# EAGLE design AuxBreak (EAGLE 6.5.0)
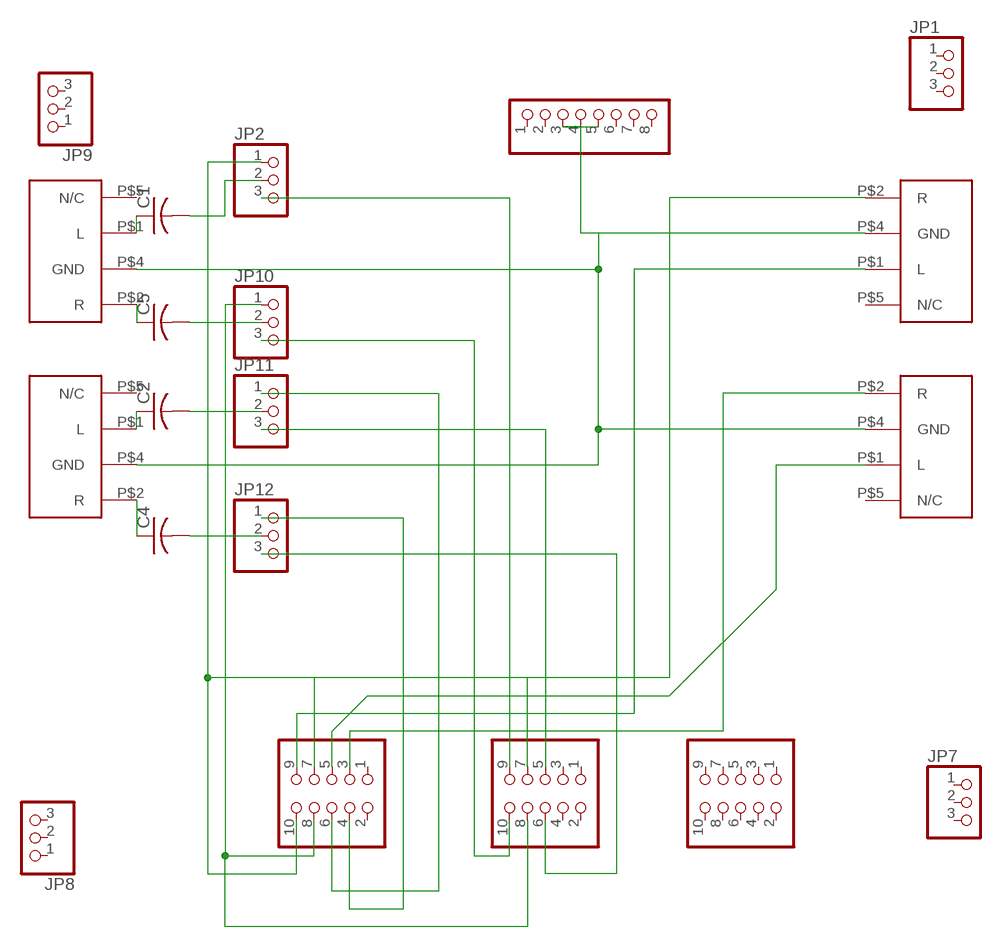
[diagram p0: schematic, sheet 1]

## Parts
C1  C-US025-025X050  [C025-025X050]
C2  C-US025-025X050  [C025-025X050]
C4  C-US025-025X050  [C025-025X050]
C5  C-US025-025X050  [C025-025X050]
JP1  PINHD-1X3  [1X03]
JP2  PINHD-1X3  [1X03]
JP3  PINHD-1X8  [1X08]
JP4  PINHD-2X5/90  [2X05/90]
JP5  PINHD-2X5/90  [2X05/90]
JP6  PINHD-2X5/90  [2X05/90]
JP7  PINHD-1X3  [1X03]
JP8  PINHD-1X3  [1X03]
JP9  PINHD-1X3  [1X03]
JP10  PINHD-1X3  [1X03]
JP11  PINHD-1X3  [1X03]
JP12  PINHD-1X3  [1X03]
U$1  161-3509-E  [161-3509-E]
U$3  161-3509-E  [161-3509-E]
U$4  161-3509-E  [161-3509-E]
U$5  161-3509-E  [161-3509-E]

## Nets
N$1: JP3.3 JP3.4 JP3.5 U$1.P$4(GND) U$3.P$4(GND) U$4.P$4(GND) U$5.P$4(GND)
N$2: C2.1 U$4.P$1(L)
N$3: C4.1 U$4.P$2(R)
N$4: C1.2 JP2.2
N$5: C5.1 U$5.P$2(R)
N$6: JP2.1 JP4.7 JP6.10
N$7: JP4.8 JP6.8 JP10.1
N$8: JP6.6 JP11.1
N$9: JP6.4 JP12.1
N$10: C4.2 JP12.2
N$11: C2.2 JP11.2
N$12: C1.1 U$5.P$1(L)
N$13: C5.2 JP10.2
N$14: JP2.3 JP4.9
N$15: JP4.5 JP11.3
N$16: JP4.10 JP10.3
N$17: JP4.6 JP12.3
N$18: JP6.9 U$3.P$1(L)
N$19: JP6.7 U$3.P$2(R)
N$20: JP6.5 U$1.P$1(L)
N$21: JP6.3 U$1.P$2(R)
Unconnected: JP1.1 JP1.2 JP1.3 JP3.1 JP3.2 JP3.6 JP3.7 JP3.8 JP4.1 JP4.2 JP4.3 JP4.4 JP5.1 JP5.2 JP5.3 JP5.4 JP5.5 JP5.6 JP5.7 JP5.8 JP5.9 JP5.10 JP6.1 JP6.2 JP7.1 JP7.2 JP7.3 JP8.1 JP8.2 JP8.3 JP9.1 JP9.2 JP9.3 U$1.P$5(N/C) U$3.P$5(N/C) U$4.P$5(N/C) U$5.P$5(N/C)

## Library data of the parts
C1 C2 C4 C5 = rcl:C-US: CAPACITOR, American symbol
JP1 JP2 JP7-JP12 = pinhead:PINHD-1X3: PIN HEADER
JP3 = pinhead:PINHD-1X8: PIN HEADER
JP4-JP6 = pinhead:PINHD-2X5: PIN HEADER
U$1 U$3-U$5 = C1-2015:161-3509-E

## Board
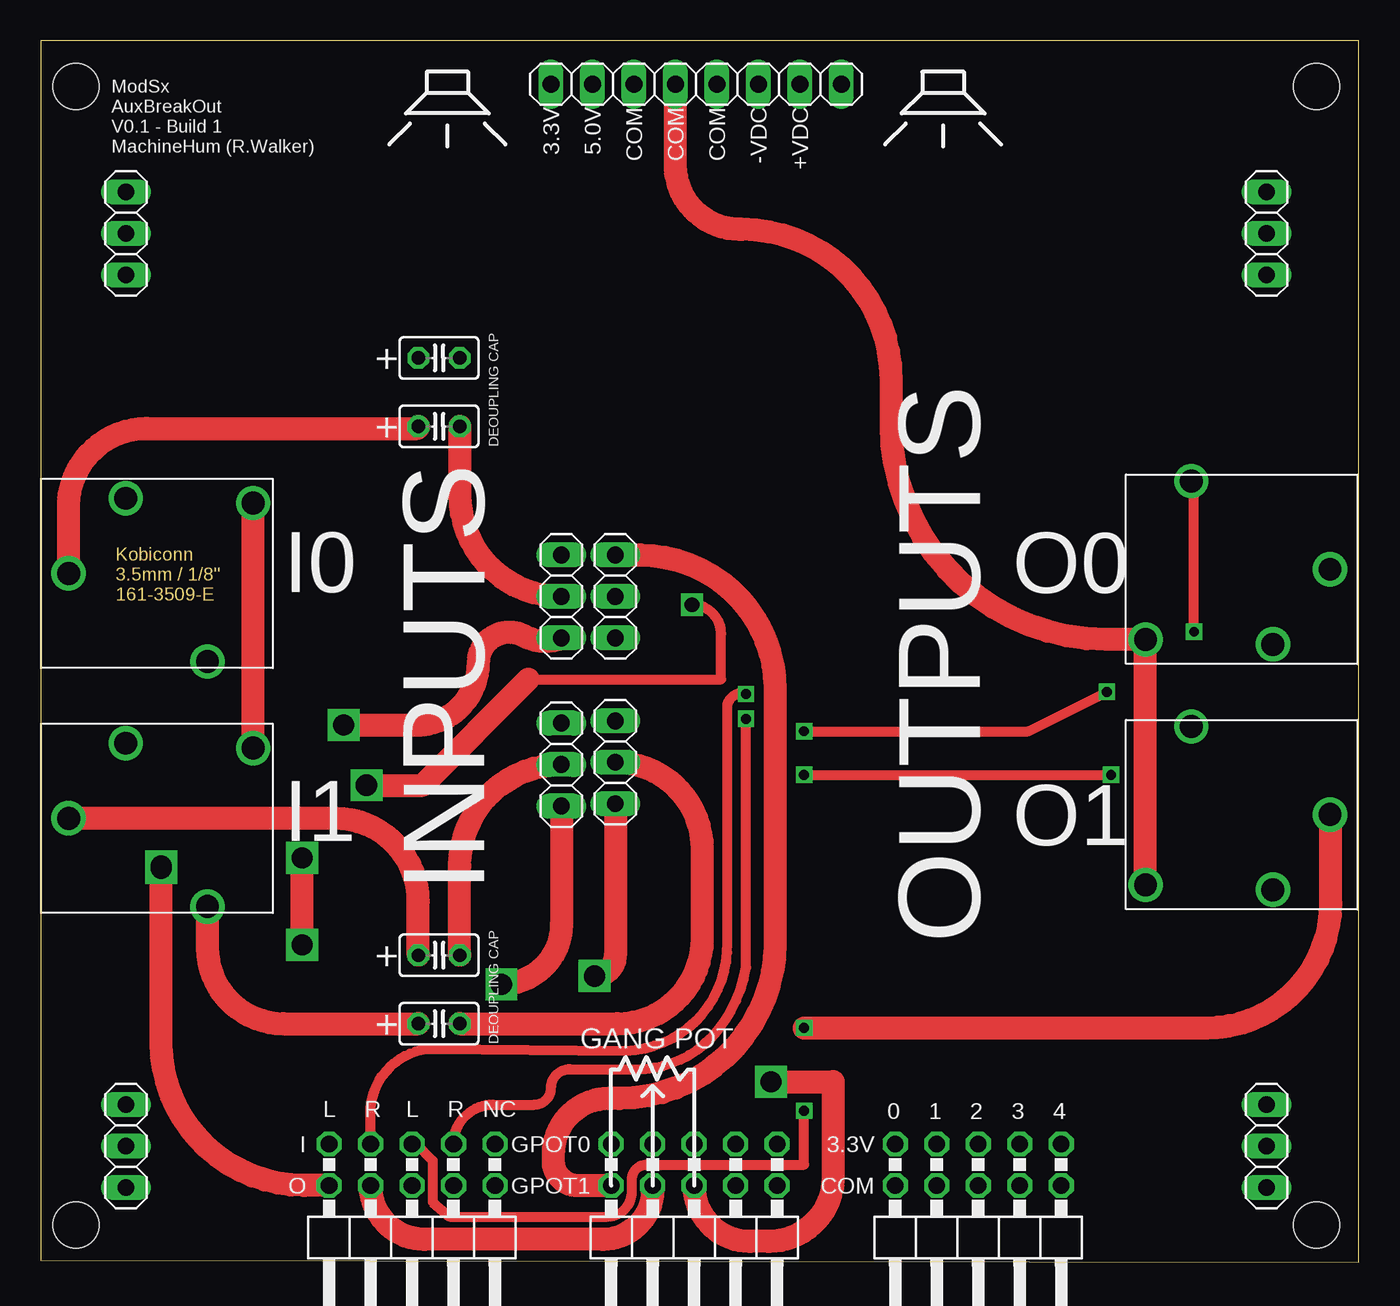
[diagram p1: board, top side]
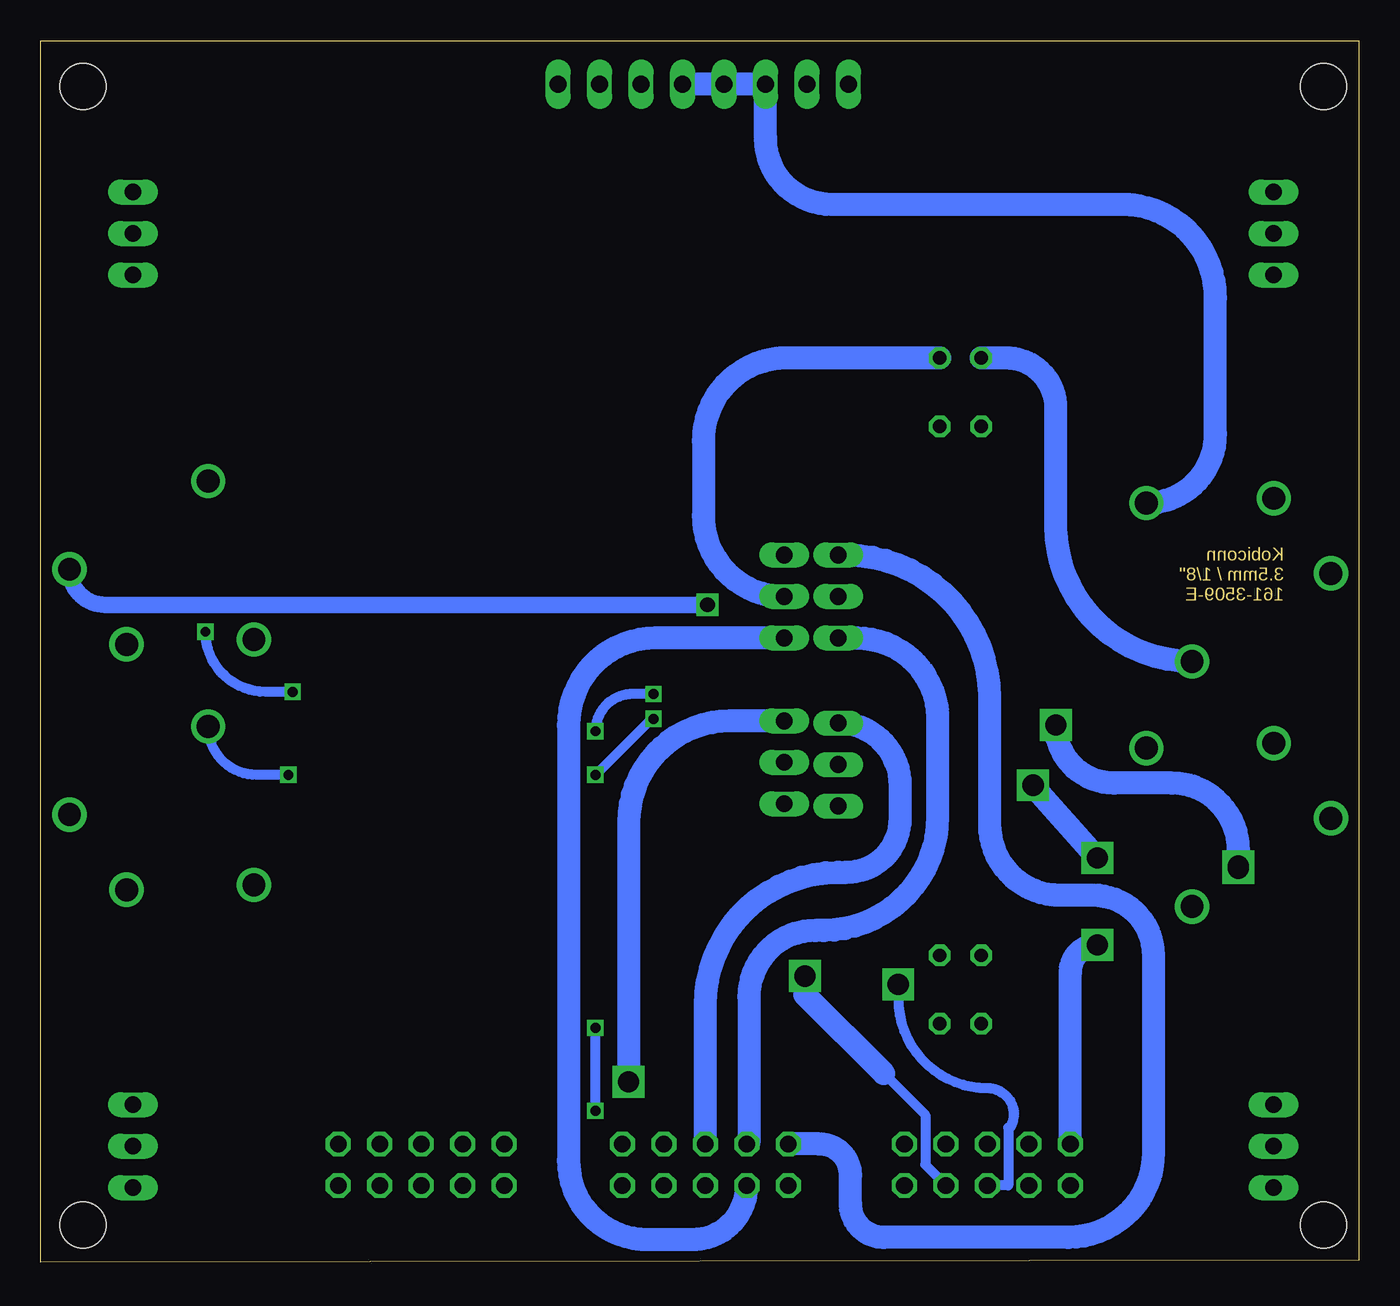
[diagram p2: board, bottom side, seen from below]

Size 80.7 x 74.79 mm. Coordinates in mm from the lower left corner, seen from the top.
Outline: 0,0.13 80.7,0 80.7,74.79 0,74.79 0,0.13
Copper layers (1*16): Top 0.035mm / dielectric 1.5mm / Bottom 0.035mm
Design rules "default": minimum track width 10mil, minimum drill 24mil, track to track 8mil, track to pad 8mil, pad to pad 8mil, via to via 8mil, smd to smd 8mil, copper to edge 40mil, drill to drill 8mil, minimum pad ring 10mil, minimum via ring 8mil, stop-mask expansion 4mil, vias tented up to drill 0mil, thermal gap 10mil
Holes 2.8 mm at 2.16,72.01 2.16,2.29 78.11,72.01 78.11,2.29

### Footprints (pad centres in the part's own frame; a part is rotated, then mirrored left to right if it is on the bottom)
C025-025X050 = drill 0.813 octagon: 1 -1.27,0; 2 1.27,0
1X03 = drill 1.016 long: 1 -2.54,0; 2 0,0; 3 2.54,0
1X08 = drill 1.016 long: 1 -8.89,0; 2 -6.35,0; 3 -3.81,0; 4 -1.27,0; 5 1.27,0; 6 3.81,0; 7 6.35,0; 8 8.89,0
2X05/90 = drill 1.016 octagon: 1 -5.08,-6.35; 2 -5.08,-3.81; 3 -2.54,-6.35; 4 -2.54,-3.81; 5 0,-6.35; 6 0,-3.81; 7 2.54,-6.35; 8 2.54,-3.81; 9 5.08,-6.35; 10 5.08,-3.81
161-3509-E = drill 1.4: P$1 1.7,-5.8; P$2 10.2,-11.2; P$4 13,-1.5; P$5 5.2,-1.2

### Placement (x,y rotation side)
C1  24.38,51.18 0 top
C2  24.38,18.8 0 top
C4  24.38,14.61 0 top
C5  24.38,55.37 0 top
JP1  5.21,62.99 90 top
JP2  31.88,40.77 90 top
JP3  40.13,72.14 0 top
JP4  40.01,0.89 180 top
JP5  57.4,0.89 180 top
JP6  22.73,0.89 180 top
JP7  75.06,62.99 90 top
JP8  5.21,7.11 90 top
JP9  75.06,7.11 90 top
JP10  35.18,40.77 90 top
JP11  31.88,30.48 90 top
JP12  35.18,30.61 90 top
U$1  80.64,21.61 180 top
U$3  80.64,36.64 180 top
U$4  0,32.98 0 top
U$5  0,47.98 0 top

### Tracks (layer width: path | path; a pad name or v marks a point on that pad's centre or on a via)
N$1
  Top 1.422: U$4.P$4 U$5.P$4 | JP3.4 38.86,67.18 arc90 42.8,63.25 42.93,63.25 arc-90 52.07,54.1 52.07,51.31 arc90 65.24,38.14 U$3.P$4 U$1.P$4
  Bottom 1.422: U$5.P$4 arc-90 8.76,50.72 8.76,59.05 arc-90 14.48,64.77 32.26,64.77 arc90 36.32,68.83 JP3.3 JP3.4 JP3.5
N$2
  Top 1.422: C2.1 23.11,22.1 arc90 18.03,27.18 U$4.P$1 arc-90 U$4.P$1
N$3
  Top 1.422: U$4.P$2 10.2,19.26 arc90 14.86,14.61 C4.1
N$4
  Top 1.422: C1.2 25.65,46.99 arc90 JP2.2
N$5
  Bottom 1.422: U$5.P$2 arc90 18.54,45.12 18.54,52.32 arc-90 21.59,55.37 C5.1
N$6  (via drill 1.3)
  Top 1.422: JP6.10 16.13,4.7 arc-90 7.37,13.46 v7.37,24.13 v7.37,24.26 | v18.54,32.89 22.99,32.89 arc90 26.8,36.7 arc-119 29.59,38.35 arc51 JP2.1
  Bottom 1.422: JP2.1 30.73,38.23 arc90 25.78,33.27 25.78,27.3 arc90 32.77,20.32 33.27,20.32 arc-90 37.34,16.26 37.34,7.37 arc90 JP4.7 | v7.37,24.26 7.37,25.27 arc-90 11.43,29.34 14.99,29.34 arc90 v18.54,32.89
N$7
  Top 1.422: JP4.8 37.47,4.44 arc-90 34.42,1.4 23.5,1.4 arc-90 JP6.8
  Bottom 1.422: JP10.1 43.05,38.23 arc-90 48.39,32.89 48.39,6.22 arc-90 43.56,1.4 40.77,1.4 arc-90 JP4.8
N$8  (via drill 1.3)
  Top 1.422: JP11.1 31.88,20.7 arc-90 v28.19,17.02
  Bottom 0.61: v28.19,17.02 28.19,16.13 arc-90 22.73,10.67 arc120 21.34,8.26 21.46,8.26 21.46,4.7 JP6.6
N$9  (via drill 1.3)
  Top 1.422: JP12.1 35.18,18.8 arc-90 v33.91,17.53
  Bottom 0.61: 29.08,11.56 26.54,9.02 26.54,5.97 JP6.4
  Bottom 1.422: v33.91,17.53 33.91,16.38 29.08,11.56
N$10
  Top 1.422: C4.2 35.31,14.61 arc90 40.51,19.81 40.51,25.27 arc90 JP12.2
N$11
  Top 1.422: C2.2 25.65,24.26 arc-90 JP11.2
N$12
  Top 1.422: U$5.P$1 1.7,46.28 arc-90 6.48,51.05 22.99,51.05 arc90 C1.1
N$13
  Bottom 1.422: C5.2 35.05,55.37 arc-90 40.13,50.29 40.13,45.72 arc-90 JP10.2
N$14
  Bottom 1.422: JP2.3 31.37,43.31 arc90 22.61,34.54 22.61,26.8 arc-90 18.29,22.48 16.26,22.48 arc90 12.57,18.8 12.57,6.73 arc90 17.78,1.52 29.08,1.52 arc90 31.11,3.56 31.11,5.33 arc-90 33.02,7.24 JP4.9
N$15
  Bottom 1.422: JP4.5 40.01,15.75 arc90 31.88,23.88 31.37,23.88 arc-90 28.07,27.18 28.07,29.21 arc-90 JP11.3
N$16
  Top 1.422: JP10.3 36.7,43.31 arc-90 44.96,35.05 44.96,19.56 arc-90 35.43,10.03 34.8,10.03 arc90 31.37,6.6 31.37,6.22 arc90 32.89,4.7 JP4.10
N$17  (via drill 1.3)
  Top 1.422: v44.7,11.05 48.51,11.05 48.51,5.21 arc-90 44.58,1.27 43.43,1.27 arc-90 JP4.6
  Bottom 1.422: JP12.3 38.48,33.15 arc-90 44.7,26.92 v44.7,11.05
N$18  (via drill 0.9, 1.3)
  Top 0.61: 29.84,35.69 41.66,35.69 41.66,38.48 arc90 v39.88,40.26
  Top 1.422: v16,19.43 v16,24.77 | v19.94,29.21 23.37,29.21 29.84,35.69
  Bottom 1.016: v39.88,40.26 76.77,40.26 arc90 U$3.P$1
  Bottom 1.422: JP6.9 17.65,17.78 arc90 v16,19.43 | v16,24.77 v19.94,29.21
N$19  (via drill 0.6)
  Top 0.61: JP6.7 20.19,9.02 arc-90 24,13.08 35.81,12.95 arc90 42.04,19.56 42.04,34.16 arc-90 v43.18,34.8 | v46.74,32.51 60.45,32.51 v65.28,34.93 | v70.61,38.61 70.61,47.67 arc90 U$3.P$2
  Bottom 0.61: v43.18,34.8 44.45,34.8 arc-90 v46.74,32.51 | v65.28,34.93 66.93,34.93 arc90 v70.61,38.61
N$20  (via drill 0.6)
  Top 0.61: JP6.5 22.99,7.24 24,6.22 24,3.68 25.02,2.79 34.67,2.79 arc90 36.2,4.32 36.2,5.08 arc-90 37.08,5.97 46.74,5.97 v46.74,9.27 | 78.99,27.36 arc90 U$1.P$1
  Top 1.422: v46.74,14.35 71.37,14.35 arc90 78.99,21.97 78.99,27.36
  Bottom 0.61: v46.74,9.27 v46.74,14.35
N$21  (via drill 0.6)
  Top 0.61: JP6.3 arc-90 27.69,9.65 30.23,9.65 arc90 31.24,10.67 arc-98 32.51,11.81 36.45,11.81 arc45 41.02,13.72 arc34 43.18,18.03 v43.18,33.27 | v46.74,29.84 v65.53,29.84
  Bottom 0.61: v43.18,33.27 43.31,33.27 v46.74,29.84 | v65.53,29.84 67.48,29.84 arc90 U$1.P$2

### Text on the board
Dimension: Kobiconn / 3.5mm / 1/8'' / 161-3509-E
tPlace: 3.3V | 5.0V | COM | COM | COM | -VDC | +VDC | ModSx / AuxBreakOut / V0.1 - Build 1 / MachineHum (R.Walker) | DEOUPLING CAP | + | + | INPUTS | I0 | O0 | I1 | O1 | DEOUPLING CAP | OUTPUTS | + | + | GANG POT | L | R | L | R | NC | 0 | 1 | 2 | 3 | 4 | I | GPOT0 | 3.3V | O | GPOT1 | COM